# EAGLE design keybaord60 (EAGLE 9.6.2)
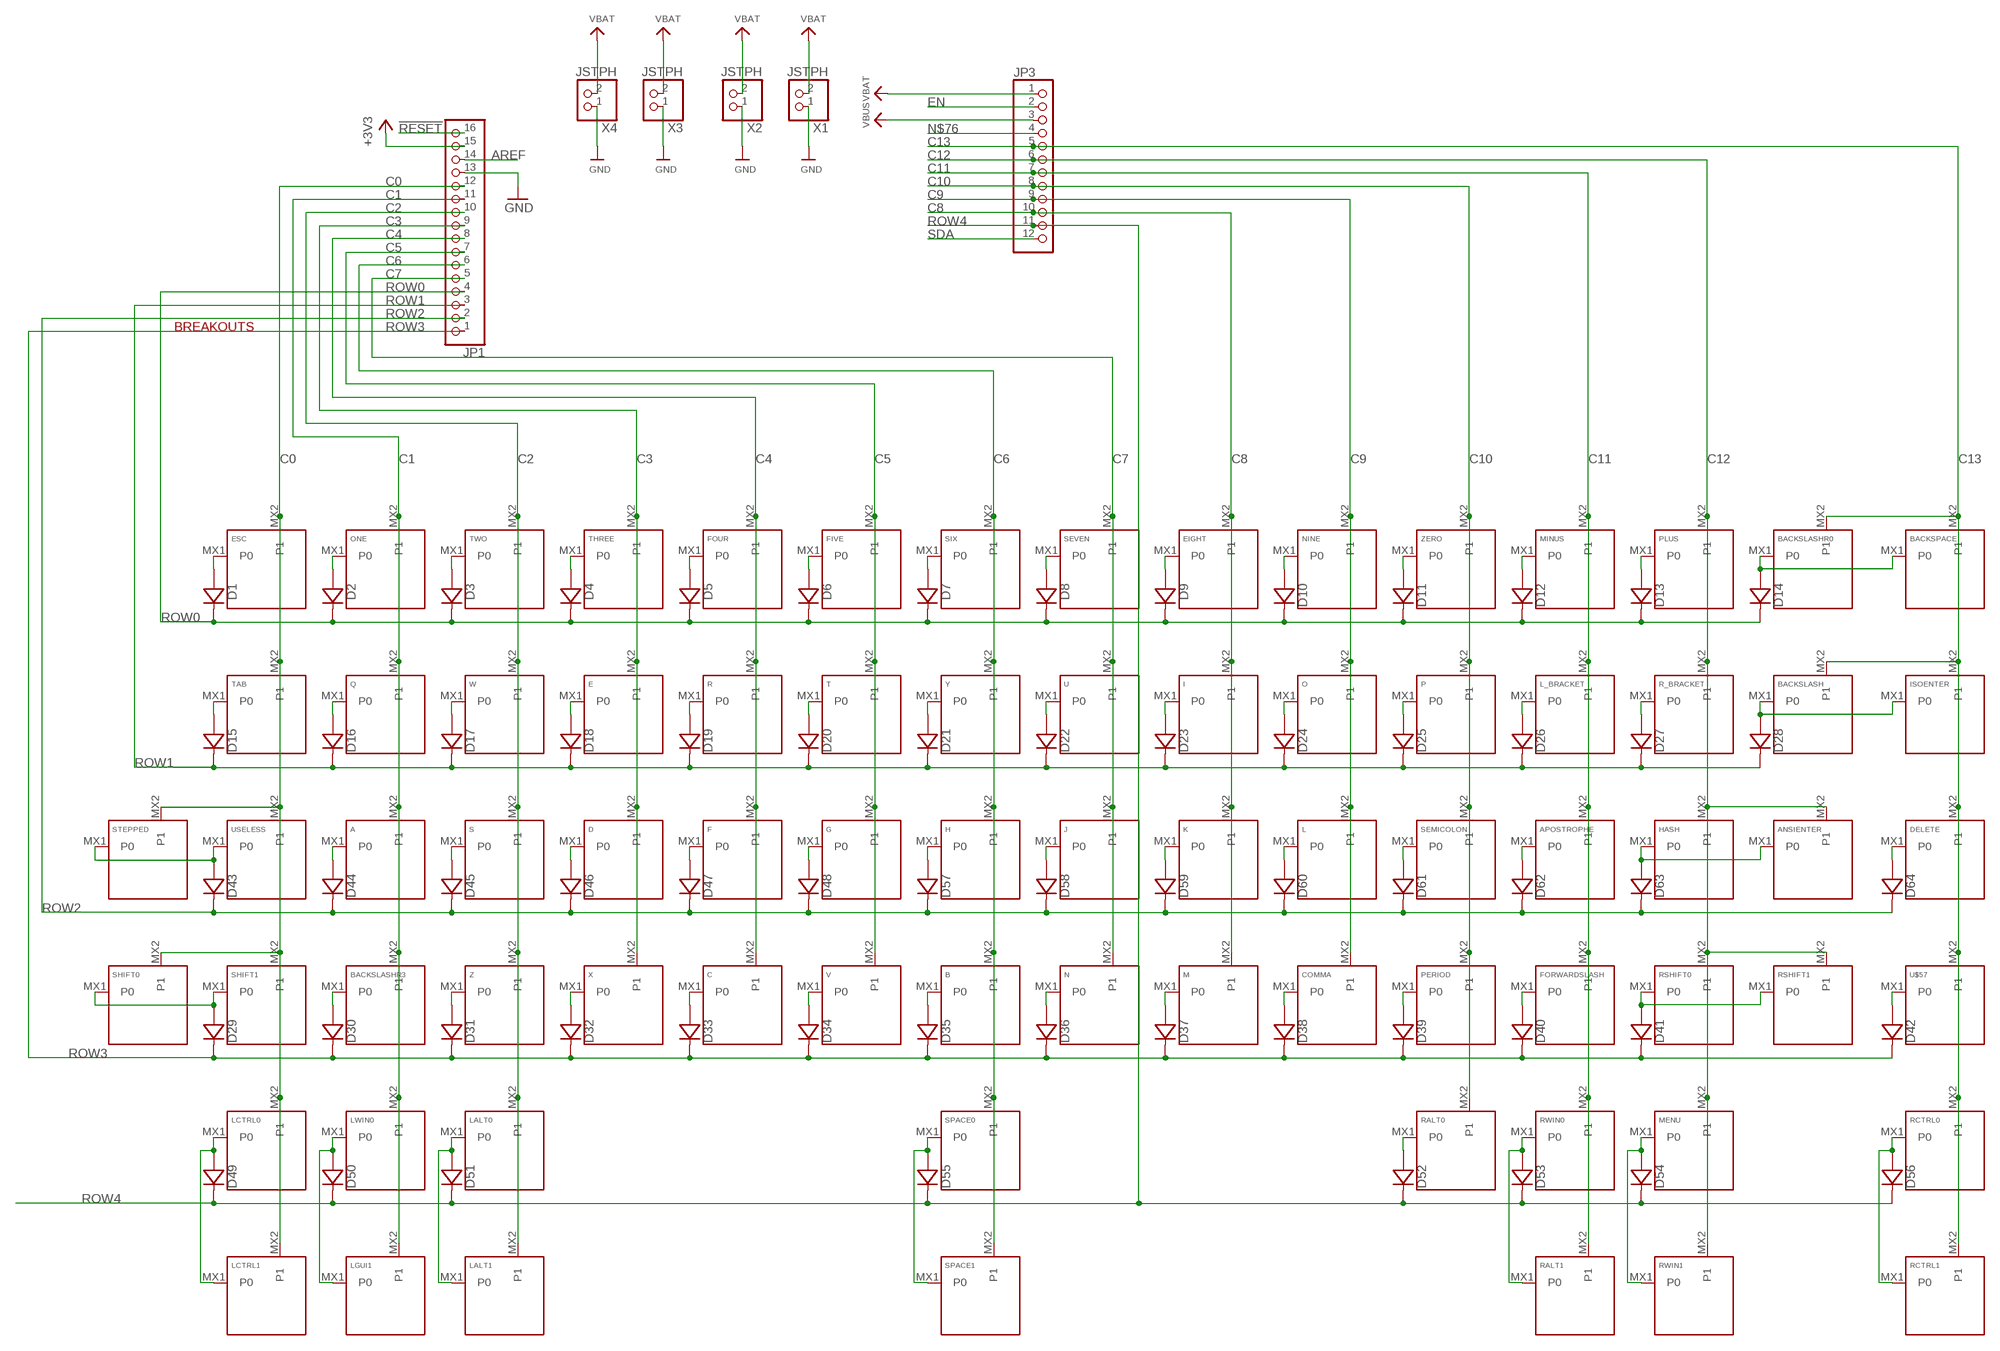
[diagram p0: schematic, sheet 1]

## Parts
A  KEYSWITCH-PLAIN-MX-1U  [MX-1U]
ANSIENTER  KEYSWITCH-PLAIN-MX-2U  [MX-2U]
APOSTROPHE  KEYSWITCH-PLAIN-MX-1U  [MX-1U]
B  KEYSWITCH-PLAIN-MX-1U  [MX-1U]
BACKSLASH  KEYSWITCH-PLAIN-MX-1U  [MX-1U]
BACKSLASHR0  KEYSWITCH-PLAIN-MX-1U  [MX-1U]
BACKSLASHR3  KEYSWITCH-PLAIN-MX-1U  [MX-1U]
BACKSPACE  KEYSWITCH-PLAIN-MX-2U  [MX-2U]
C  KEYSWITCH-PLAIN-MX-1U  [MX-1U]
COMMA  KEYSWITCH-PLAIN-MX-1U  [MX-1U]
D  KEYSWITCH-PLAIN-MX-1U  [MX-1U]
D1  DIODE-SOD-123  [SOD-123]
D2  DIODE-SOD-123  [SOD-123]
D3  DIODE-SOD-123  [SOD-123]
D4  DIODE-SOD-123  [SOD-123]
D5  DIODE-SOD-123  [SOD-123]
D6  DIODE-SOD-123  [SOD-123]
D7  DIODE-SOD-123  [SOD-123]
D8  DIODE-SOD-123  [SOD-123]
D9  DIODE-SOD-123  [SOD-123]
D10  DIODE-SOD-123  [SOD-123]
D11  DIODE-SOD-123  [SOD-123]
D12  DIODE-SOD-123  [SOD-123]
D13  DIODE-SOD-123  [SOD-123]
D14  DIODE-SOD-123  [SOD-123]
D15  DIODE-SOD-123  [SOD-123]
D16  DIODE-SOD-123  [SOD-123]
D17  DIODE-SOD-123  [SOD-123]
D18  DIODE-SOD-123  [SOD-123]
D19  DIODE-SOD-123  [SOD-123]
D20  DIODE-SOD-123  [SOD-123]
D21  DIODE-SOD-123  [SOD-123]
D22  DIODE-SOD-123  [SOD-123]
D23  DIODE-SOD-123  [SOD-123]
D24  DIODE-SOD-123  [SOD-123]
D25  DIODE-SOD-123  [SOD-123]
D26  DIODE-SOD-123  [SOD-123]
D27  DIODE-SOD-123  [SOD-123]
D28  DIODE-SOD-123  [SOD-123]
D29  DIODE-SOD-123  [SOD-123]
D30  DIODE-SOD-123  [SOD-123]
D31  DIODE-SOD-123  [SOD-123]
D32  DIODE-SOD-123  [SOD-123]
D33  DIODE-SOD-123  [SOD-123]
D34  DIODE-SOD-123  [SOD-123]
D35  DIODE-SOD-123  [SOD-123]
D36  DIODE-SOD-123  [SOD-123]
D37  DIODE-SOD-123  [SOD-123]
D38  DIODE-SOD-123  [SOD-123]
D39  DIODE-SOD-123  [SOD-123]
D40  DIODE-SOD-123  [SOD-123]
D41  DIODE-SOD-123  [SOD-123]
D42  DIODE-SOD-123  [SOD-123]
D43  DIODE-SOD-123  [SOD-123]
D44  DIODE-SOD-123  [SOD-123]
D45  DIODE-SOD-123  [SOD-123]
D46  DIODE-SOD-123  [SOD-123]
D47  DIODE-SOD-123  [SOD-123]
D48  DIODE-SOD-123  [SOD-123]
D49  DIODE-SOD-123  [SOD-123]
D50  DIODE-SOD-123  [SOD-123]
D51  DIODE-SOD-123  [SOD-123]
D52  DIODE-SOD-123  [SOD-123]
D53  DIODE-SOD-123  [SOD-123]
D54  DIODE-SOD-123  [SOD-123]
D55  DIODE-SOD-123  [SOD-123]
D56  DIODE-SOD-123  [SOD-123]
D57  DIODE-SOD-123  [SOD-123]
D58  DIODE-SOD-123  [SOD-123]
D59  DIODE-SOD-123  [SOD-123]
D60  DIODE-SOD-123  [SOD-123]
D61  DIODE-SOD-123  [SOD-123]
D62  DIODE-SOD-123  [SOD-123]
D63  DIODE-SOD-123  [SOD-123]
D64  DIODE-SOD-123  [SOD-123]
DELETE  KEYSWITCH-PLAIN-MX-1U  [MX-1U]
E  KEYSWITCH-PLAIN-MX-1U  [MX-1U]
EIGHT  KEYSWITCH-PLAIN-MX-1U  [MX-1U]
ESC  KEYSWITCH-PLAIN-MX-1U  [MX-1U]
F  KEYSWITCH-PLAIN-MX-1U  [MX-1U]
FIVE  KEYSWITCH-PLAIN-MX-1U  [MX-1U]
FORWARDSLASH  KEYSWITCH-PLAIN-MX-1U  [MX-1U]
FOUR  KEYSWITCH-PLAIN-MX-1U  [MX-1U]
G  KEYSWITCH-PLAIN-MX-1U  [MX-1U]
H  KEYSWITCH-PLAIN-MX-1U  [MX-1U]
HASH  KEYSWITCH-PLAIN-MX-1U  [MX-1U]
I  KEYSWITCH-PLAIN-MX-1U  [MX-1U]
ISOENTER  KEYSWITCH-PLAIN-MX-2U-ROTATED  [MX-2U-ROTATED]
J  KEYSWITCH-PLAIN-MX-1U  [MX-1U]
JP1  HEADER-1X16ROUND  [1X16_ROUND]
JP3  HEADER-1X12  [1X12_ROUND]
K  KEYSWITCH-PLAIN-MX-1U  [MX-1U]
L  KEYSWITCH-PLAIN-MX-1U  [MX-1U]
L_BRACKET  KEYSWITCH-PLAIN-MX-1U  [MX-1U]
LALT0  KEYSWITCH-PLAIN-MX-1U  [MX-1U]
LALT1  KEYSWITCH-PLAIN-MX-1U  [MX-1U]
LCTRL0  KEYSWITCH-PLAIN-MX-1U  [MX-1U]
LCTRL1  KEYSWITCH-PLAIN-MX-1U  [MX-1U]
LGUI1  KEYSWITCH-PLAIN-MX-1U  [MX-1U]
LWIN0  KEYSWITCH-PLAIN-MX-1U  [MX-1U]
M  KEYSWITCH-PLAIN-MX-1U  [MX-1U]
MENU  KEYSWITCH-PLAIN-MX-1U  [MX-1U]
MINUS  KEYSWITCH-PLAIN-MX-1U  [MX-1U]
N  KEYSWITCH-PLAIN-MX-1U  [MX-1U]
NINE  KEYSWITCH-PLAIN-MX-1U  [MX-1U]
O  KEYSWITCH-PLAIN-MX-1U  [MX-1U]
ONE  KEYSWITCH-PLAIN-MX-1U  [MX-1U]
P  KEYSWITCH-PLAIN-MX-1U  [MX-1U]
PERIOD  KEYSWITCH-PLAIN-MX-1U  [MX-1U]
PLUS  KEYSWITCH-PLAIN-MX-1U  [MX-1U]
Q  KEYSWITCH-PLAIN-MX-1U  [MX-1U]
R  KEYSWITCH-PLAIN-MX-1U  [MX-1U]
R_BRACKET  KEYSWITCH-PLAIN-MX-1U  [MX-1U]
RALT0  KEYSWITCH-PLAIN-MX-1U  [MX-1U]
RALT1  KEYSWITCH-PLAIN-MX-1U  [MX-1U]
RCTRL0  KEYSWITCH-PLAIN-MX-1U  [MX-1U]
RCTRL1  KEYSWITCH-PLAIN-MX-1U  [MX-1U]
RSHIFT0  KEYSWITCH-PLAIN-MX-1U  [MX-1U]
RSHIFT1  KEYSWITCH-PLAIN-MX-2U  [MX-2U]
RWIN0  KEYSWITCH-PLAIN-MX-1U  [MX-1U]
RWIN1  KEYSWITCH-PLAIN-MX-1U  [MX-1U]
S  KEYSWITCH-PLAIN-MX-1U  [MX-1U]
SEMICOLON  KEYSWITCH-PLAIN-MX-1U  [MX-1U]
SEVEN  KEYSWITCH-PLAIN-MX-1U  [MX-1U]
SHIFT0  KEYSWITCH-PLAIN-MX-1U  [MX-1U]
SHIFT1  KEYSWITCH-PLAIN-MX-2U  [MX-2U]
SIX  KEYSWITCH-PLAIN-MX-1U  [MX-1U]
SPACE0  KEYSWITCH-PLAIN-MX-6.25U-FLIPPED  [MX-6.25U-FLIPPED]
SPACE1  KEYSWITCH-PLAIN-MX-7U-FLIPPED  [MX-7U-FLIPPED]
STEPPED  KEYSWITCH-PLAIN-MX-1U  [MX-1U]
T  KEYSWITCH-PLAIN-MX-1U  [MX-1U]
TAB  KEYSWITCH-PLAIN-MX-1U  [MX-1U]
THREE  KEYSWITCH-PLAIN-MX-1U  [MX-1U]
TWO  KEYSWITCH-PLAIN-MX-1U  [MX-1U]
U  KEYSWITCH-PLAIN-MX-1U  [MX-1U]
U$57  KEYSWITCH-PLAIN-MX-1U  [MX-1U]
USELESS  KEYSWITCH-PLAIN-MX-1U  [MX-1U]
V  KEYSWITCH-PLAIN-MX-1U  [MX-1U]
W  KEYSWITCH-PLAIN-MX-1U  [MX-1U]
X  KEYSWITCH-PLAIN-MX-1U  [MX-1U]
X1  JSTPH  CON_JST_PH_2PIN  [JSTPH2]
X2  JSTPH  CON_JST_PH_2PIN  [JSTPH2]
X3  JSTPH  CON_JST_PH_2PIN  [JSTPH2]
X4  JSTPH  CON_JST_PH_2PIN  [JSTPH2]
Y  KEYSWITCH-PLAIN-MX-1U  [MX-1U]
Z  KEYSWITCH-PLAIN-MX-1U  [MX-1U]
ZERO  KEYSWITCH-PLAIN-MX-1U  [MX-1U]

## Nets
!RESET: JP1.16
+3V3 [power]: JP1.15
AREF: JP1.14
C0: ESC.MX2(P1) JP1.12 LCTRL0.MX2(P1) LCTRL1.MX2(P1) SHIFT0.MX2(P1) SHIFT1.MX2(P1) STEPPED.MX2(P1) TAB.MX2(P1) USELESS.MX2(P1)
C1: A.MX2(P1) BACKSLASHR3.MX2(P1) JP1.11 LGUI1.MX2(P1) LWIN0.MX2(P1) ONE.MX2(P1) Q.MX2(P1)
C2: JP1.10 LALT0.MX2(P1) LALT1.MX2(P1) S.MX2(P1) TWO.MX2(P1) W.MX2(P1) Z.MX2(P1)
C3: D.MX2(P1) E.MX2(P1) JP1.9 THREE.MX2(P1) X.MX2(P1)
C4: C.MX2(P1) F.MX2(P1) FOUR.MX2(P1) JP1.8 R.MX2(P1)
C5: FIVE.MX2(P1) G.MX2(P1) JP1.7 T.MX2(P1) V.MX2(P1)
C6: B.MX2(P1) H.MX2(P1) JP1.6 SIX.MX2(P1) SPACE0.MX2(P1) SPACE1.MX2(P1) Y.MX2(P1)
C7: J.MX2(P1) JP1.5 N.MX2(P1) SEVEN.MX2(P1) U.MX2(P1)
C8: EIGHT.MX2(P1) I.MX2(P1) JP3.10 K.MX2(P1) M.MX2(P1)
C9: COMMA.MX2(P1) JP3.9 L.MX2(P1) NINE.MX2(P1) O.MX2(P1)
C10: JP3.8 P.MX2(P1) PERIOD.MX2(P1) RALT0.MX2(P1) SEMICOLON.MX2(P1) ZERO.MX2(P1)
C11: APOSTROPHE.MX2(P1) FORWARDSLASH.MX2(P1) JP3.7 L_BRACKET.MX2(P1) MINUS.MX2(P1) RALT1.MX2(P1) RWIN0.MX2(P1)
C12: ANSIENTER.MX2(P1) HASH.MX2(P1) JP3.6 MENU.MX2(P1) PLUS.MX2(P1) R_BRACKET.MX2(P1) RSHIFT0.MX2(P1) RSHIFT1.MX2(P1) RWIN1.MX2(P1)
C13: BACKSLASH.MX2(P1) BACKSLASHR0.MX2(P1) BACKSPACE.MX2(P1) DELETE.MX2(P1) ISOENTER.MX2(P1) JP3.5 RCTRL0.MX2(P1) RCTRL1.MX2(P1) U$57.MX2(P1)
EN: JP3.2
GND [gnd]: JP1.13 X1.1 X2.1 X3.1 X4.1
N$1: D1.A ESC.MX1(P0)
N$2: D2.A ONE.MX1(P0)
N$3: D3.A TWO.MX1(P0)
N$4: D4.A THREE.MX1(P0)
N$5: D5.A FOUR.MX1(P0)
N$6: D6.A FIVE.MX1(P0)
N$7: D7.A SIX.MX1(P0)
N$8: D8.A SEVEN.MX1(P0)
N$9: D9.A EIGHT.MX1(P0)
N$10: D10.A NINE.MX1(P0)
N$11: D11.A ZERO.MX1(P0)
N$12: D12.A MINUS.MX1(P0)
N$13: D13.A PLUS.MX1(P0)
N$14: BACKSLASHR0.MX1(P0) BACKSPACE.MX1(P0) D14.A
N$15: D15.A TAB.MX1(P0)
N$16: D16.A Q.MX1(P0)
N$17: D17.A W.MX1(P0)
N$18: D18.A E.MX1(P0)
N$19: D19.A R.MX1(P0)
N$20: D20.A T.MX1(P0)
N$21: D21.A Y.MX1(P0)
N$22: D22.A U.MX1(P0)
N$23: D23.A I.MX1(P0)
N$24: D24.A O.MX1(P0)
N$25: D25.A P.MX1(P0)
N$26: D26.A L_BRACKET.MX1(P0)
N$27: D27.A R_BRACKET.MX1(P0)
N$28: BACKSLASH.MX1(P0) D28.A ISOENTER.MX1(P0)
N$29: D43.A STEPPED.MX1(P0) USELESS.MX1(P0)
N$30: A.MX1(P0) D44.A
N$31: D45.A S.MX1(P0)
N$32: D46.A D.MX1(P0)
N$33: D47.A F.MX1(P0)
N$34: D48.A G.MX1(P0)
N$35: D57.A H.MX1(P0)
N$36: D58.A J.MX1(P0)
N$37: D59.A K.MX1(P0)
N$38: D60.A L.MX1(P0)
N$39: D61.A SEMICOLON.MX1(P0)
N$40: APOSTROPHE.MX1(P0) D62.A
N$41: ANSIENTER.MX1(P0) D63.A HASH.MX1(P0)
N$42: D64.A DELETE.MX1(P0)
N$43: D29.A SHIFT0.MX1(P0) SHIFT1.MX1(P0)
N$44: BACKSLASHR3.MX1(P0) D30.A
N$45: D31.A Z.MX1(P0)
N$46: D32.A X.MX1(P0)
N$47: C.MX1(P0) D33.A
N$48: D34.A V.MX1(P0)
N$49: B.MX1(P0) D35.A
N$50: D36.A N.MX1(P0)
N$51: D37.A M.MX1(P0)
N$52: COMMA.MX1(P0) D38.A
N$53: D39.A PERIOD.MX1(P0)
N$54: D40.A FORWARDSLASH.MX1(P0)
N$55: D41.A RSHIFT0.MX1(P0) RSHIFT1.MX1(P0)
N$56: D42.A U$57.MX1(P0)
N$57: D49.A LCTRL0.MX1(P0) LCTRL1.MX1(P0)
N$58: D50.A LGUI1.MX1(P0) LWIN0.MX1(P0)
N$59: D51.A LALT0.MX1(P0) LALT1.MX1(P0)
N$60: D52.A RALT0.MX1(P0)
N$61: D53.A RALT1.MX1(P0) RWIN0.MX1(P0)
N$62: D54.A MENU.MX1(P0) RWIN1.MX1(P0)
N$63: D55.A SPACE0.MX1(P0) SPACE1.MX1(P0)
N$64: D56.A RCTRL0.MX1(P0) RCTRL1.MX1(P0)
N$76: JP3.4
ROW0: D1.C D2.C D3.C D4.C D5.C D6.C D7.C D8.C D9.C D10.C D11.C D12.C D13.C D14.C JP1.4
ROW1: D15.C D16.C D17.C D18.C D19.C D20.C D21.C D22.C D23.C D24.C D25.C D26.C D27.C D28.C JP1.3
ROW2: D43.C D44.C D45.C D46.C D47.C D48.C D57.C D58.C D59.C D60.C D61.C D62.C D63.C D64.C JP1.2
ROW3: D29.C D30.C D31.C D32.C D33.C D34.C D35.C D36.C D37.C D38.C D39.C D40.C D41.C D42.C JP1.1
ROW4: D49.C D50.C D51.C D52.C D53.C D54.C D55.C D56.C JP3.11
SDA: JP3.12
VBAT [power]: JP3.1 X1.2 X2.2 X3.2 X4.2
VBUS [power]: JP3.3

## Notes on the sheet
- BREAKOUTS

## Library data of the parts
A ANSIENTER APOSTROPHE B BACKSLASH BACKSLASHR0 BACKSLASHR3 BACKSPACE C COMMA D DELETE E EIGHT ESC F FIVE FORWARDSLASH FOUR G H HASH I ISOENTER J K L L_BRACKET LALT0 LALT1 LCTRL0 LCTRL1 LGUI1 LWIN0 M MENU MINUS N NINE O ONE P PERIOD PLUS Q R R_BRACKET RALT0 RALT1 RCTRL0 RCTRL1 RSHIFT0 RSHIFT1 RWIN0 RWIN1 S SEMICOLON SEVEN SHIFT0 SHIFT1 SIX SPACE0 SPACE1 STEPPED T TAB THREE TWO U U$57 USELESS V W X Y Z ZERO = Keyboard:KEYSWITCH-PLAIN
D1-D64 = Components:DIODE: Standard 1N4148 diode
JP1 = microbuilder:HEADER-1X16: PIN HEADER
JP3 = microbuilder:HEADER-1X12
X1-X4 = microbuilder:CON_JST_PH_2PIN: JST 2-Pin Right-Angle Connector PH-Series - 4UConnector: 17311 SH-Series - 4UConnector: 07278

## Net classes
1 power: width 0.305 mm
2 gnd: width 0.254 mm

## Board
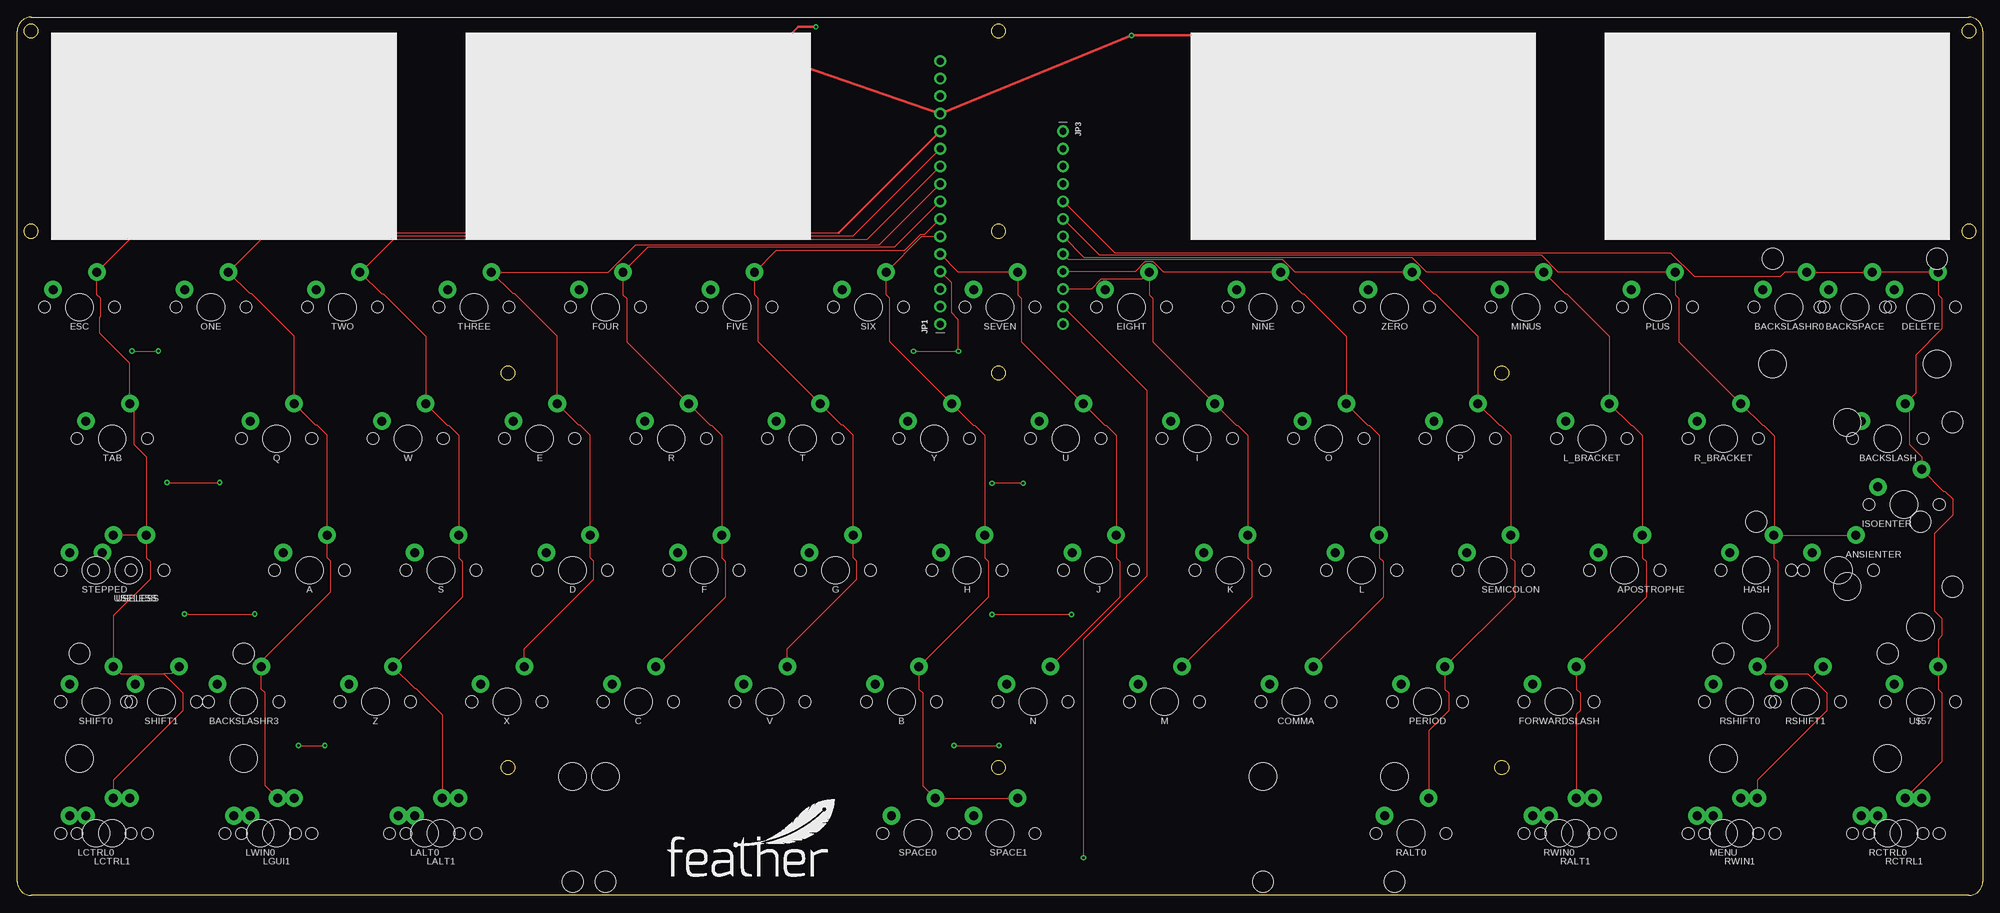
[diagram p1: board, top side]
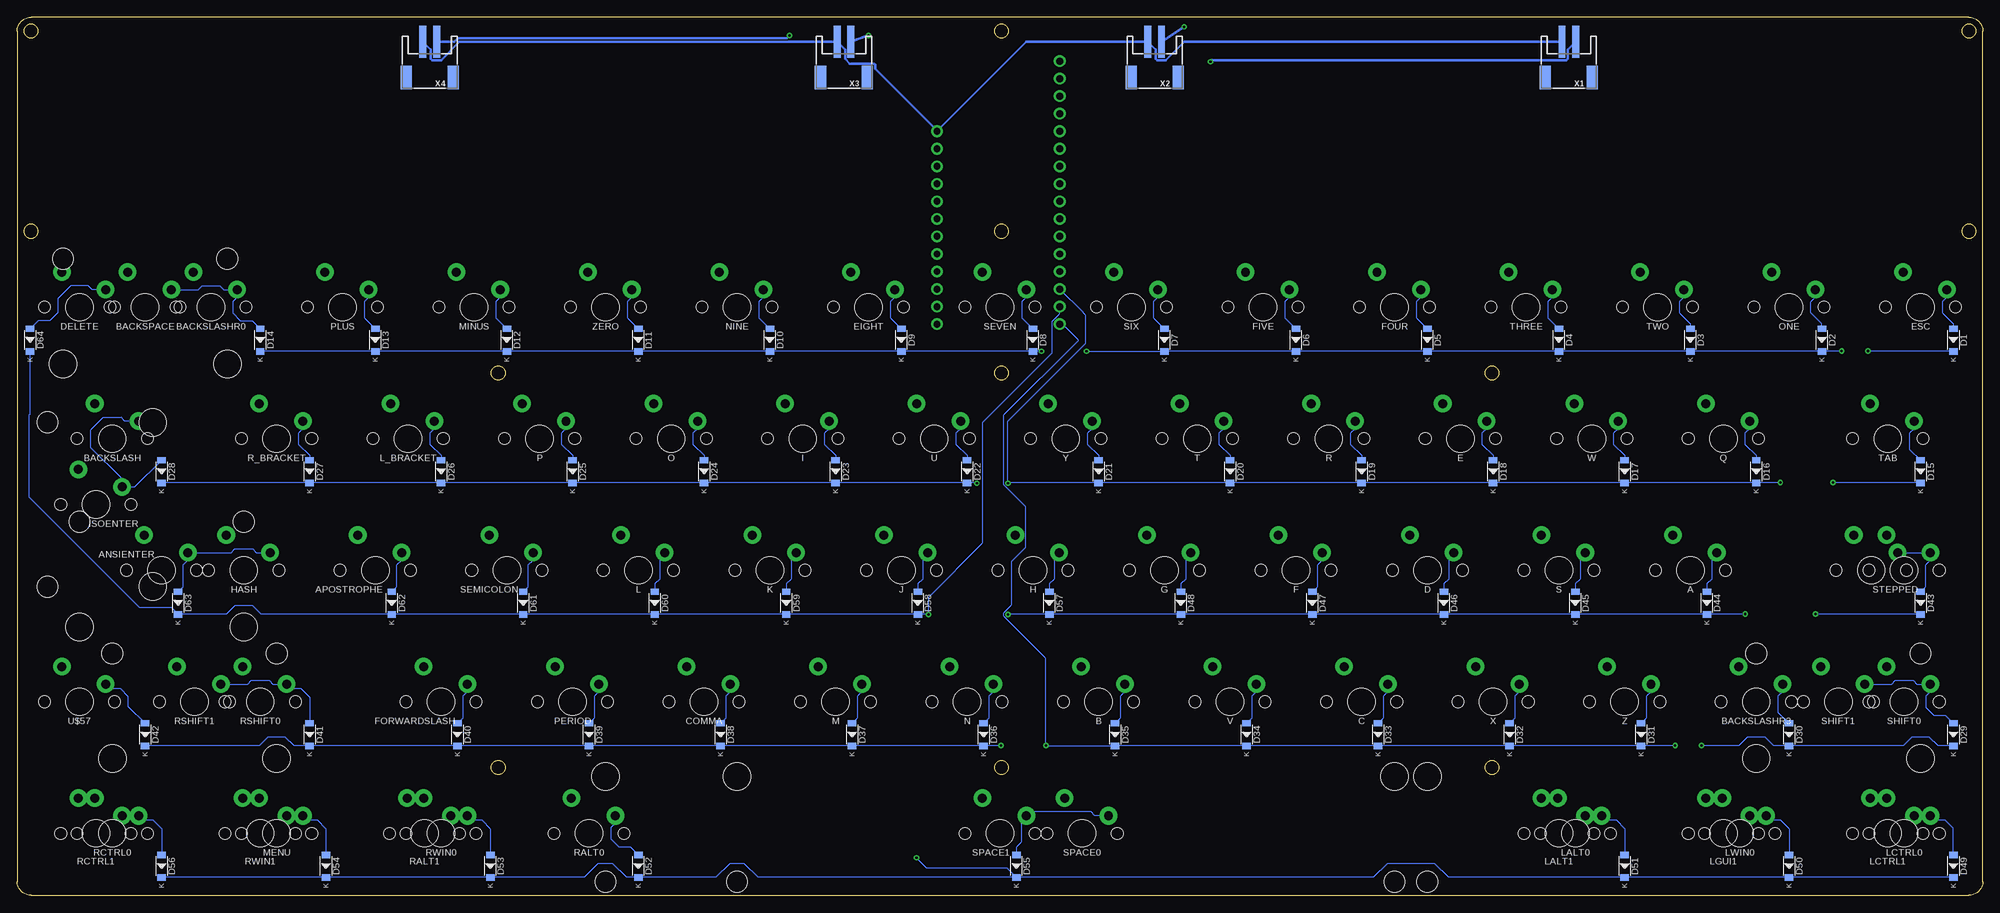
[diagram p2: board, bottom side, seen from below]

Size 284.7 x 127.2 mm. Coordinates in mm from the lower left corner, seen from the top.
Outline: 0,2 arc90 2,0
Outline: 2,127.2 arc90 0,125.2
Outline: 284.7,125.2 arc90 282.7,127.2
Outline: 282.7,0 arc90 284.7,2
Outline: 0,2 arc90 2,0
Outline: 2,127.2 arc90 0,125.2
Outline: 2,127.2 282.7,127.2
Outline: 284.7,125.2 arc90 282.7,127.2
Outline: 284.7,125.2 284.7,2
Outline: 282.7,0 arc90 284.7,2
Outline: 282.7,0 2,0
Outline: 0,2 0,125.2
Outline: 0,2 arc90 2,0
Outline: circle at 71.06,18.53 radius 1
Outline: circle at 215.02,18.53 radius 1
Outline: circle at 142.11,18.53 radius 1
Outline: circle at 142.11,75.68 radius 1
Outline: circle at 71.06,75.68 radius 1
Outline: circle at 215.02,75.68 radius 1
Outline: circle at 2,96.2 radius 1
Outline: circle at 142.11,96.2 radius 1
Outline: circle at 282.7,96.2 radius 1
Outline: circle at 2,125.2 radius 1
Outline: circle at 282.7,125.2 radius 1
Outline: circle at 142.11,125.2 radius 1
Copper layers (1*16): Top 0.035mm / dielectric 1.5mm / Bottom 0.035mm
Design rules "default": minimum track width 6mil, minimum drill 0.35mm, track to track 6mil, track to pad 6mil, pad to pad 6mil, via to via 6mil, smd to smd 6mil, copper to edge 40mil, drill to drill 6mil, minimum pad ring 10mil, minimum via ring 8mil, stop-mask expansion 4mil, vias tented up to drill 0mil, thermal gap 10mil

### Footprints (pad centres in the part's own frame; a part is rotated, then mirrored left to right if it is on the bottom)
MX-1U = drill 1.3 pad 2.54: MX1 -3.81,2.54; MX2 2.54,5.08 | hole 4: 0,0 | hole 1.7: -5.08,0; 5.08,0
MX-2U = drill 1.3 pad 2.54: MX1 -3.81,2.54; MX2 2.54,5.08 | hole 4: 0,0; -11.9,-8.24; 11.9,-8.24 | hole 1.7: -5.08,0; 5.08,0 | hole 3.05: -11.9,7; 11.9,7
SOD-123 = smd 0.91 x 1.22: A -1.635,0; C 1.635,0
MX-2U-ROTATED = drill 1.3 pad 2.54: MX1 -3.81,2.54; MX2 2.54,5.08 | hole 4: 0,0; -8.24,-11.9; -8.24,11.9 | hole 1.7: -5.08,0; 5.08,0 | hole 3.05: 7,-11.9; 7,11.9
1X16_ROUND = drill 1 pad 1.676: 1 -19.05,0; 2 -16.51,0; 3 -13.97,0; 4 -11.43,0; 5 -8.89,0; 6 -6.35,0; 7 -3.81,0; 8 -1.27,0; 9 1.27,0; 10 3.81,0; 11 6.35,0; 12 8.89,0; 13 11.43,0; 14 13.97,0; 15 16.51,0; 16 19.05,0
1X12_ROUND = drill 1 pad 1.676: 1 -13.97,0; 2 -11.43,0; 3 -8.89,0; 4 -6.35,0; 5 -3.81,0; 6 -1.27,0; 7 1.27,0; 8 3.81,0; 9 6.35,0; 10 8.89,0; 11 11.43,0; 12 13.97,0
MX-6.25U-FLIPPED = drill 1.3 pad 2.54: MX1 -3.81,2.54; MX2 2.54,5.08 | hole 4: 0,0; -50,8.24; 50,8.24 | hole 1.7: -5.08,0; 5.08,0 | hole 3.05: -50,-7; 50,-7
MX-7U-FLIPPED = drill 1.3 pad 2.54: MX1 -3.81,2.54; MX2 2.54,5.08 | hole 4: 0,0; -57.15,8.24; 57.15,8.24 | hole 1.7: -5.08,0; 5.08,0 | hole 3.05: -57.15,-7; 57.15,-7
JSTPH2 = smd 1 x 4.6: 1 -1,-3.7; 2 1,-3.7 | smd 1.6 x 3.4: NC1 -3.4,1.5; NC2 3.4,1.5

### Placement (x,y rotation side)
A  42.34,47.1 0 top
ANSIENTER  263.79,47.1 0 top
APOSTROPHE  232.84,47.1 0 top
B  128.06,28.05 0 top
BACKSLASH  270.94,66.15 0 top
BACKSLASHR0  256.65,85.2 0 top
BACKSLASHR3  32.81,28.05 0 top
BACKSPACE  266.18,85.2 0 top
C  89.96,28.05 0 top
COMMA  185.21,28.05 0 top
D  80.44,47.1 0 top
D1  4.24,80.44 270 bottom
D2  23.29,80.44 270 bottom
D3  42.34,80.44 270 bottom
D4  61.39,80.44 270 bottom
D5  80.44,80.44 270 bottom
D6  99.49,80.44 270 bottom
D7  118.54,80.44 270 bottom
D8  137.59,80.44 270 bottom
D9  156.64,80.44 270 bottom
D10  175.69,80.44 270 bottom
D11  194.74,80.44 270 bottom
D12  213.79,80.44 270 bottom
D13  232.84,80.44 270 bottom
D14  249.51,80.44 270 bottom
D15  9,61.39 270 bottom
D16  32.81,61.39 270 bottom
D17  51.86,61.39 270 bottom
D18  70.91,61.39 270 bottom
D19  89.96,61.39 270 bottom
D20  109.01,61.39 270 bottom
D21  128.06,61.39 270 bottom
D22  147.11,61.39 270 bottom
D23  166.16,61.39 270 bottom
D24  185.21,61.39 270 bottom
D25  204.26,61.39 270 bottom
D26  223.31,61.39 270 bottom
D27  242.36,61.39 270 bottom
D28  263.79,61.39 270 bottom
D29  4.24,23.29 270 bottom
D30  28.05,23.29 270 bottom
D31  49.48,23.29 270 bottom
D32  68.53,23.29 270 bottom
D33  87.58,23.29 270 bottom
D34  106.63,23.29 270 bottom
D35  125.68,23.29 270 bottom
D36  144.73,23.29 270 bottom
D37  163.78,23.29 270 bottom
D38  182.83,23.29 270 bottom
D39  201.88,23.29 270 bottom
D40  220.93,23.29 270 bottom
D41  242.36,23.29 270 bottom
D42  266.18,23.29 270 bottom
D43  9,42.34 270 bottom
D44  39.96,42.34 270 bottom
D45  59.01,42.34 270 bottom
D46  78.06,42.34 270 bottom
D47  97.11,42.34 270 bottom
D48  116.16,42.34 270 bottom
D49  4.24,4.24 270 bottom
D50  28.05,4.24 270 bottom
D51  51.86,4.24 270 bottom
D52  194.74,4.24 270 bottom
D53  216.17,4.24 270 bottom
D54  239.98,4.24 270 bottom
D55  139.97,4.24 270 bottom
D56  263.79,4.24 270 bottom
D57  135.21,42.34 270 bottom
D58  154.26,42.34 270 bottom
D59  173.31,42.34 270 bottom
D60  192.36,42.34 270 bottom
D61  211.41,42.34 270 bottom
D62  230.46,42.34 270 bottom
D63  261.41,42.34 270 bottom
D64  282.84,80.44 270 bottom
DELETE  275.7,85.2 0 top
E  75.67,66.15 0 top
EIGHT  161.4,85.2 0 top
ESC  9,85.2 0 top
F  99.49,47.1 0 top
FIVE  104.25,85.2 0 top
FORWARDSLASH  223.31,28.05 0 top
FOUR  85.2,85.2 0 top
G  118.54,47.1 0 top
H  137.59,47.1 0 top
HASH  251.89,47.1 0 top
I  170.92,66.15 0 top
ISOENTER  273.32,56.63 0 top
J  156.64,47.1 0 top
JP1  133.7,101.8 90 top
JP3  151.48,96.72 270 top
K  175.69,47.1 0 top
L  194.74,47.1 0 top
L_BRACKET  228.07,66.15 0 top
LALT0  59.01,9 0 top
LALT1  61.39,9 0 top
LCTRL0  11.38,9 0 top
LCTRL1  13.76,9 0 top
LGUI1  37.58,9 0 top
LWIN0  35.19,9 0 top
M  166.16,28.05 0 top
MENU  247.12,9 0 top
MINUS  218.55,85.2 0 top
N  147.11,28.05 0 top
NINE  180.45,85.2 0 top
O  189.97,66.15 0 top
ONE  28.05,85.2 0 top
P  209.02,66.15 0 top
PERIOD  204.26,28.05 0 top
PLUS  237.6,85.2 0 top
Q  37.58,66.15 0 top
R  94.73,66.15 0 top
R_BRACKET  247.12,66.15 0 top
RALT0  201.88,9 0 top
RALT1  225.69,9 0 top
RCTRL0  270.94,9 0 top
RCTRL1  273.32,9 0 top
RSHIFT0  249.51,28.05 0 top
RSHIFT1  259.03,28.05 0 top
RWIN0  223.31,9 0 top
RWIN1  249.51,9 0 top
S  61.39,47.1 0 top
SEMICOLON  213.79,47.1 0 top
SEVEN  142.35,85.2 0 top
SHIFT0  11.38,28.05 0 top
SHIFT1  20.91,28.05 0 top
SIX  123.3,85.2 0 top
SPACE0  130.44,9 0 top
SPACE1  142.35,9 0 top
STEPPED  11.38,47.1 0 top
T  113.78,66.15 0 top
TAB  13.76,66.15 0 top
THREE  66.15,85.2 0 top
TWO  47.1,85.2 0 top
U  151.88,66.15 0 top
U$1  [FEATHERLOGO]  94.09,2.65 0 top
U$57  275.7,28.05 0 top
USELESS  16.14,47.1 0 top
V  109.01,28.05 0 top
W  56.62,66.15 0 top
X  70.91,28.05 0 top
X1  59.95,119.95 180 bottom
X2  119.95,119.95 180 bottom
X3  164.95,119.95 180 bottom
X4  224.95,119.95 180 bottom
Y  132.82,66.15 0 top
Z  51.86,28.05 0 top
ZERO  199.5,85.2 0 top

### Tracks (layer width: path | path; a pad name or v marks a point on that pad's centre or on a via)
C0
  Top 0.152: USELESS.MX2 18.68,63.56 16.9,65.35 16.9,70.63 TAB.MX2 16.3,77.1 11.95,81.45 11.95,83.78 12.09,83.92 12.09,86.48 11.54,87.03 ESC.MX2 17.21,95.95 118.96,95.95 | USELESS.MX2 STEPPED.MX2 | USELESS.MX2 18.68,48.93 19.24,48.38 19.24,45.82 13.92,40.5 SHIFT0.MX2 14.96,32.09 21.24,32.09 | 21.24,32.09 24,29.33 24,26.77 13.92,16.69 LCTRL0.MX2 LCTRL1.MX2 | SHIFT1.MX2 22.4,32.09 21.24,32.09
  Top 0.381: 118.96,95.95 JP1.12
C1
  Top 0.152: LGUI1.MX2 LWIN0.MX2 35.91,15.91 35.91,29.33 35.35,29.88 BACKSLASHR3.MX2 35.35,33.9 45.43,43.97 45.43,48.38 44.88,48.93 A.MX2 44.88,66.67 43.46,68.09 43.25,68.09 Q.MX2 40.11,80.96 33.93,87.14 33.73,87.14 ONE.MX2 35.76,95.45 121,95.45 JP1.11
C2
  Top 0.152: TWO.MX2 49.71,90.21 | 49.71,90.21 52.78,87.14 52.98,87.14 59.17,80.96 W.MX2 62.3,68.09 62.51,68.09 63.93,66.67 S.MX2 63.93,48.93 64.48,48.38 64.48,43.21 Z.MX2 57.54,29.99 57.75,29.99 61.55,26.19 LALT0.MX2 LALT1.MX2 | JP1.10 123.04,94.95 54.45,94.95 49.71,90.21
C3
  Top 0.152: X.MX2 73.45,35.74 83.53,45.82 83.53,48.38 82.98,48.93 D.MX2 82.98,66.67 81.56,68.09 81.35,68.09 E.MX2 78.22,80.96 72.03,87.14 71.83,87.14 THREE.MX2 85.62,90.28 89.59,94.26 124.89,94.26 JP1.9
C4
  Top 0.152: C.MX2 102.58,43.21 102.58,48.38 102.03,48.93 F.MX2 102.03,66.67 100.61,68.09 100.4,68.09 R.MX2 88.29,80.2 88.29,86.48 87.74,87.03 FOUR.MX2 91.41,93.95 127.12,93.95 JP1.8
C5
  Top 0.152: V.MX2 111.55,35.74 121.63,45.82 121.63,48.38 121.08,48.93 G.MX2 121.08,66.67 119.66,68.09 119.45,68.09 T.MX2 107.34,80.2 107.34,86.48 106.79,87.03 FIVE.MX2 109.96,93.45 128.58,93.45 130.88,95.76 131.46,95.76 JP1.7
C6
  Top 0.152: SPACE1.MX2 SPACE0.MX2 131.16,15.91 131.16,29.33 130.6,29.88 B.MX2 140.68,43.21 140.68,48.38 140.13,48.93 H.MX2 140.13,66.67 138.71,68.09 138.5,68.09 Y.MX2 126.39,80.2 126.39,86.48 125.84,87.03 SIX.MX2 131.01,95.45 JP1.6
C7
  Top 0.152: N.MX2 159.73,43.21 159.73,48.38 159.18,48.93 J.MX2 159.18,66.67 157.76,68.09 157.55,68.09 U.MX2 145.44,80.2 145.44,86.48 144.89,87.03 SEVEN.MX2 136.33,90.28 JP1.5
C8
  Top 0.152: M.MX2 178.78,43.21 178.78,48.38 178.23,48.93 K.MX2 178.23,66.67 176.81,68.09 176.6,68.09 I.MX2 164.49,80.2 164.49,86.48 163.94,87.03 EIGHT.MX2 162.9,89.24 156.97,89.24 155.56,87.83 JP3.10
C9
  Top 0.152: COMMA.MX2 197.83,43.21 197.83,48.38 197.28,48.93 L.MX2 197.28,66.67 195.86,68.09 195.65,68.09 O.MX2 192.51,80.96 186.33,87.14 186.13,87.14 NINE.MX2 166.06,90.28 164.56,91.78 163.32,91.78 161.91,90.37 JP3.9
C10
  Top 0.152: RALT0.MX2 204.42,23.84 207.35,26.77 207.35,29.33 206.8,29.88 PERIOD.MX2 216.88,43.21 216.88,48.38 216.33,48.93 SEMICOLON.MX2 216.33,66.67 214.91,68.09 214.7,68.09 P.MX2 211.56,80.96 205.38,87.14 205.18,87.14 ZERO.MX2 185.11,90.28 183.31,92.08 152.31,92.08 JP3.8
C11
  Top 0.152: RALT1.MX2 RWIN0.MX2 225.85,26.22 226.41,26.77 226.41,29.33 225.85,29.88 FORWARDSLASH.MX2 235.93,43.21 235.93,48.38 235.38,48.93 APOSTROPHE.MX2 235.38,66.67 233.96,68.09 233.75,68.09 L_BRACKET.MX2 230.61,80.96 224.43,87.14 224.23,87.14 MINUS.MX2 204.16,90.28 202.05,92.39 154.54,92.39 JP3.7
C12
  Top 0.152: HASH.MX2 254.43,52.93 254.51,53.02 254.51,66.59 253.01,68.09 252.8,68.09 R_BRACKET.MX2 240.69,80.2 240.69,86.48 240.14,87.03 PLUS.MX2 223.21,90.28 220.8,92.69 156.78,92.69 JP3.6 | HASH.MX2 254.43,48.93 254.99,48.38 254.99,36.07 RSHIFT0.MX2 253.09,32.09 259.37,32.09 260.03,31.43 | 260.03,31.43 262.12,29.33 262.12,26.77 252.05,16.69 RWIN1.MX2 MENU.MX2 | 260.03,31.43 260.03,31.59 RSHIFT1.MX2 | HASH.MX2 ANSIENTER.MX2
C13
  Top 0.152: RCTRL1.MX2 RCTRL0.MX2 278.79,19.4 278.79,29.33 278.24,29.88 U$57.MX2 278.24,37.03 278.79,37.58 278.79,40.14 277.7,41.23 277.7,52.41 280.34,55.05 280.34,57.43 279.2,58.57 279,58.57 ISOENTER.MX2 275.86,63.56 274.07,65.35 274.07,70.63 BACKSLASH.MX2 274.98,72.74 274.98,78.24 278.79,82.05 278.79,86.48 278.24,87.03 DELETE.MX2 BACKSPACE.MX2 BACKSLASHR0.MX2 256.06,90.28 255.36,89.58 242.96,89.58 239.54,93 159.01,93 JP3.5
GND  (via drill 0.35)
  Top 0.381: v115.68,125.81 115.68,125.84 113.14,125.84 111.87,124.57 v111.87,120.76 JP1.13 v161.4,124.57 v172.83,124.57
  Bottom 0.381: X1.1 60.11,122.49 60.11,121.21 60.31,121.01 111.62,121.01 v111.87,120.76 | v115.68,125.81 X2.1 | X4.1 221.42,123.65 220.89,124.18 173.22,124.18 v172.83,124.57 | v161.4,124.57 X3.1
N$1
  Bottom 0.152: ESC.MX1 5.19,86.68 5.86,86 5.86,84.4 4.24,82.77 D1.A
N$2
  Bottom 0.152: D2.A 23.29,82.77 24.91,84.4 24.91,86 24.24,86.68 ONE.MX1
N$3
  Bottom 0.152: TWO.MX1 43.29,86.68 43.96,86 43.96,84.4 42.34,82.77 D3.A
N$4
  Bottom 0.152: THREE.MX1 62.34,86.68 63.01,86 63.01,83.7 D4.A
N$5
  Bottom 0.152: FOUR.MX1 81.39,86.68 82.06,86 82.06,83.7 D5.A
N$6
  Bottom 0.152: FIVE.MX1 100.44,86.68 101.11,86 101.11,83.7 D6.A
N$7
  Bottom 0.152: SIX.MX1 119.49,86.68 120.16,86 120.16,83.7 D7.A
N$8
  Bottom 0.152: SEVEN.MX1 138.54,86.68 139.21,86 139.21,83.7 D8.A
N$9
  Bottom 0.152: EIGHT.MX1 157.59,86.68 158.26,86 158.26,83.7 D9.A
N$10
  Bottom 0.152: NINE.MX1 176.64,86.68 177.31,86 177.31,83.7 D10.A
N$11
  Bottom 0.152: ZERO.MX1 195.69,86.68 196.36,86 196.36,83.7 D11.A
N$12
  Bottom 0.152: MINUS.MX1 214.74,86.68 215.41,86 215.41,83.7 D12.A
N$13
  Bottom 0.152: PLUS.MX1 233.79,86.68 234.46,86 234.46,83.7 D13.A
N$14
  Bottom 0.152: D14.A 250.69,83.26 252.37,83.26 253.51,84.4 253.51,86 252.84,86.68 BACKSLASHR0.MX1 254.82,87.74 255.37,88.29 257.93,88.29 258.48,87.74 BACKSPACE.MX1
N$15
  Bottom 0.152: TAB.MX1 9.95,67.63 10.62,66.95 10.62,64.65 D15.A
N$16
  Bottom 0.152: Q.MX1 33.77,67.63 34.44,66.95 34.44,65.35 32.81,63.72 D16.A
N$17
  Bottom 0.152: W.MX1 52.81,67.63 53.49,66.95 53.49,65.35 51.86,63.72 D17.A
N$18
  Bottom 0.152: E.MX1 71.87,67.63 72.54,66.95 72.54,65.35 70.91,63.72 D18.A
N$19
  Bottom 0.152: R.MX1 90.92,67.63 91.59,66.95 91.59,65.35 89.96,63.72 D19.A
N$20
  Bottom 0.152: T.MX1 109.97,67.63 110.64,66.95 110.64,65.35 109.01,63.72 D20.A
N$21
  Bottom 0.152: Y.MX1 129.01,67.63 129.69,66.95 129.69,65.35 128.06,63.72 D21.A
N$22
  Bottom 0.152: U.MX1 148.06,67.63 148.74,66.95 148.74,65.35 147.11,63.72 D22.A
N$23
  Bottom 0.152: I.MX1 167.11,67.63 167.79,66.95 167.79,65.35 166.16,63.72 D23.A
N$24
  Bottom 0.152: O.MX1 186.16,67.63 186.84,66.95 186.84,65.35 185.21,63.72 D24.A
N$25
  Bottom 0.152: P.MX1 205.21,67.63 205.89,66.95 205.89,65.35 204.26,63.72 D25.A
N$26
  Bottom 0.152: L_BRACKET.MX1 224.26,67.63 224.94,66.95 224.94,65.35 223.31,63.72 D26.A
N$27
  Bottom 0.152: R_BRACKET.MX1 243.31,67.63 243.99,66.95 243.99,65.35 242.36,63.72 D27.A
N$28
  Bottom 0.152: D28.A 267.65,59.17 ISOENTER.MX1 269.51,60.35 274.03,64.87 274.03,67.43 272.22,69.24 269.66,69.24 269.1,68.69 BACKSLASH.MX1
N$29
  Bottom 0.152: USELESS.MX1 STEPPED.MX1 7.57,48.58 8.24,47.9 8.24,44.73 D43.A
N$30
  Bottom 0.152: D44.A 39.96,45.11 39.25,45.82 39.25,48.92 A.MX1
N$31
  Bottom 0.152: D45.A 59.01,45.11 58.3,45.82 58.3,48.92 S.MX1
N$32
  Bottom 0.152: D46.A 78.06,45.11 77.34,45.82 77.34,48.92 D.MX1
N$33
  Bottom 0.152: F.MX1 95.68,48.58 96.35,47.9 96.35,44.73 D47.A
N$34
  Bottom 0.152: D48.A 116.16,45.11 115.45,45.82 115.45,48.92 G.MX1
N$35
  Bottom 0.152: D57.A 135.21,45.11 134.49,45.82 134.49,48.92 H.MX1
N$36
  Bottom 0.152: D58.A 154.26,45.11 153.54,45.82 153.54,48.92 J.MX1
N$37
  Bottom 0.152: D59.A 173.31,45.11 172.59,45.82 172.59,48.92 K.MX1
N$38
  Bottom 0.152: D60.A 192.36,45.11 191.64,45.82 191.64,48.92 L.MX1
N$39
  Bottom 0.152: SEMICOLON.MX1 209.98,48.58 210.65,47.9 210.65,44.73 D61.A
N$40
  Bottom 0.152: APOSTROPHE.MX1 229.03,48.58 229.7,47.9 229.7,44.73 D62.A
N$41
  Bottom 0.152: D63.A 260.66,44.73 260.66,47.9 259.98,48.58 ANSIENTER.MX1 253.72,49.64 253.17,50.19 250.61,50.19 250.05,49.64 HASH.MX1
N$42
  Bottom 0.152: DELETE.MX1 273.87,87.74 274.42,88.29 276.98,88.29 278.84,86.44 278.84,84.4 279.98,83.26 281.66,83.26 D64.A
N$43
  Bottom 0.152: D29.A 5.42,26.11 7.11,26.11 8.24,27.25 8.24,28.85 7.57,29.53 SHIFT0.MX1 9.55,30.59 10.1,31.14 12.66,31.14 13.21,30.59 SHIFT1.MX1
N$44
  Bottom 0.152: BACKSLASHR3.MX1 29,29.53 29.68,28.85 29.68,26.55 D30.A
N$45
  Bottom 0.152: Z.MX1 48.05,29.53 48.72,28.85 48.72,25.68 D31.A
N$46
  Bottom 0.152: X.MX1 67.1,29.53 67.78,28.85 67.78,25.68 D32.A
N$47
  Bottom 0.152: C.MX1 86.15,29.53 86.83,28.85 86.83,25.68 D33.A
N$48
  Bottom 0.152: V.MX1 105.2,29.53 105.88,28.85 105.88,25.68 D34.A
N$49
  Bottom 0.152: B.MX1 124.25,29.53 124.92,28.85 124.92,25.68 D35.A
N$50
  Bottom 0.152: N.MX1 143.3,29.53 143.97,28.85 143.97,25.68 D36.A
N$51
  Bottom 0.152: M.MX1 162.35,29.53 163.02,28.85 163.02,25.68 D37.A
N$52
  Bottom 0.152: COMMA.MX1 181.4,29.53 182.07,28.85 182.07,25.68 D38.A
N$53
  Bottom 0.152: PERIOD.MX1 200.45,29.53 201.12,28.85 201.12,25.68 D39.A
N$54
  Bottom 0.152: FORWARDSLASH.MX1 219.5,29.53 220.17,28.85 220.17,25.68 D40.A
N$55
  Bottom 0.152: D41.A 242.36,28.73 243.62,29.99 245.1,29.99 RSHIFT0.MX1 247.67,30.59 248.22,31.14 250.79,31.14 251.34,30.59 RSHIFT1.MX1
N$56
  Bottom 0.152: U$57.MX1 271.29,29.99 269.82,29.99 268.68,28.85 268.68,27.43 D42.A
N$57
  Bottom 0.152: D49.A 4.36,5.99 4.36,9.8 5.5,10.94 6.97,10.94 LCTRL0.MX1 LCTRL1.MX1
N$58
  Bottom 0.152: D50.A 28.05,9.68 29.31,10.94 30.79,10.94 LWIN0.MX1 LGUI1.MX1
N$59
  Bottom 0.152: D51.A 51.86,9.68 53.12,10.94 54.6,10.94 LALT0.MX1 LALT1.MX1
N$60
  Bottom 0.152: RALT0.MX1 198.07,10.48 198.74,9.8 198.74,8.2 197.61,7.06 195.92,7.06 D52.A
N$61
  Bottom 0.152: D53.A 216.17,9.68 217.43,10.94 218.91,10.94 RWIN0.MX1 RALT1.MX1
N$62
  Bottom 0.152: D54.A 239.98,9.68 241.24,10.94 242.72,10.94 MENU.MX1 RWIN1.MX1
N$63
  Bottom 0.152: D55.A 139.97,7.01 139.26,7.72 139.26,10.82 SPACE1.MX1 137.99,12.09 129.16,12.09 128.61,11.54 SPACE0.MX1
N$64
  Bottom 0.152: D56.A 263.79,9.68 265.05,10.94 266.53,10.94 RCTRL0.MX1 RCTRL1.MX1
ROW0  (via drill 0.35)
  Top 0.152: v16.62,78.85 v20.43,78.85 | v129.82,78.83 v136.32,78.83 136.32,83.4 135.33,84.4 135.33,88.74 JP1.4
  Bottom 0.152: D8.C 137.7,78.8 | 137.7,78.8 D9.C D10.C D11.C D12.C D13.C D14.C | D1.C 15.35,78.85 v16.62,78.85 | v20.43,78.85 D2.C D3.C D4.C D5.C D6.C D7.C 129.8,78.8 v129.82,78.83 | v136.32,78.83 137.68,78.83 137.7,78.8
ROW1  (via drill 0.35)
  Top 0.152: v21.7,59.8 v29.32,59.8 | v145.7,59.7 v141.2,59.7
  Bottom 0.152: D28.C D27.C D26.C D25.C D24.C D23.C D22.C 145.75,59.75 v145.7,59.7 | D15.C v21.7,59.8 | v29.32,59.8 D16.C D17.C D18.C D19.C D20.C D21.C 141.15,59.75 v141.2,59.7 141.2,68.7 129.95,79.95 129.95,84.02 130.32,84.4 130.32,84.45 JP1.3
ROW2  (via drill 0.35)
  Top 0.152: v24.24,40.75 v34.4,40.75 | v141.2,40.7 v152.7,40.7
  Bottom 0.152: D64.C 282.84,69.7 282.94,69.61 282.94,57.64 266.93,41.63 262.34,41.63 D63.C 254.42,40.7 253.18,41.95 250.61,41.95 249.36,40.7 D62.C D61.C D60.C D59.C D58.C v152.7,40.7 152.7,43.21 144.85,51.06 144.85,68.55 134.77,78.63 134.77,83.19 133.7,84.26 JP1.2 | D43.C v24.24,40.75 | v34.4,40.75 D44.C D45.C D46.C D47.C D48.C D57.C v141.2,40.7
ROW3  (via drill 0.35)
  Top 0.152: v40.75,21.7 v44.56,21.7 | v135.7,21.7 v142.2,21.7
  Bottom 0.152: D29.C 6.48,21.65 7.72,22.9 10.29,22.9 11.54,21.65 D30.C 30.28,21.65 31.53,22.9 34.09,22.9 35.34,21.65 v40.75,21.7 | D31.C 49.64,21.65 | 49.64,21.65 D32.C D33.C D34.C D35.C 135.65,21.65 v135.7,21.7 135.7,34.34 141.81,40.45 141.81,40.95 140.68,42.08 140.68,48.38 138.63,50.43 138.63,56.27 141.81,59.45 141.81,69.59 130.95,80.45 133.25,82.75 JP1.1 | D42.C 249.66,21.65 248.41,22.9 245.85,22.9 244.6,21.65 D41.C D40.C D39.C D38.C D37.C D36.C 144.68,21.7 v142.2,21.7 | v44.56,21.7 49.64,21.65
ROW4  (via drill 0.35)
  Top 0.152: v154.45,5.45 154.45,37.09 163.66,46.3 163.66,73.11 JP3.11
  Bottom 0.152: D49.C D50.C D51.C 77.34,2.6 79.36,4.62 86.28,4.62 88.3,2.6 D55.C | D55.C 177.34,2.6 179.36,4.62 181.53,4.62 183.54,2.6 D52.C 196.4,2.6 198.42,4.62 200.58,4.62 202.6,2.6 D53.C D54.C D56.C | D55.C 141.32,3.95 152.95,3.95 v154.45,5.45
VBAT
  Bottom 0.381: X1.2 115.67,123.65 118.31,121.01 119.59,121.01 119.79,121.21 119.79,122.49 X2.2 138.52,123.65 151.41,110.77 | 151.41,110.77 JP3.1 | 151.41,110.77 160.41,119.77 160.41,120.29 160.61,120.49 164.08,120.49 164.79,121.21 164.79,122.49 X3.2 220.66,123.65 223.31,121.01 224.59,121.01 224.79,121.21 224.79,122.49 X4.2